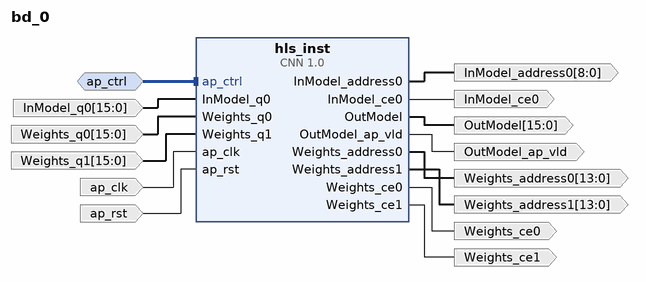
[diagram p0: block diagram of the top level]
# Vivado block design bd_0, xck26-sfvc784-2LV-c, Vivado 2023.1
create_bd_design bd_0

create_bd_intf_port -mode Slave -vlnv xilinx.com:interface:acc_handshake_rtl:1.0 ap_ctrl
create_bd_port -dir O -from 8 -to 0 -type data InModel_address0
create_bd_port -dir O InModel_ce0
create_bd_port -dir I -from 15 -to 0 -type data InModel_q0
create_bd_port -dir O -from 15 -to 0 -type data OutModel
create_bd_port -dir O OutModel_ap_vld
create_bd_port -dir O -from 13 -to 0 -type data Weights_address0
create_bd_port -dir O -from 13 -to 0 -type data Weights_address1
create_bd_port -dir O Weights_ce0
create_bd_port -dir O Weights_ce1
create_bd_port -dir I -from 15 -to 0 -type data Weights_q0
create_bd_port -dir I -from 15 -to 0 -type data Weights_q1
create_bd_port -dir I -type clk ap_clk
set_property -dict {CONFIG.FREQ_HZ 200000000.0} [get_bd_ports ap_clk]
create_bd_port -dir I -type rst ap_rst
set_property -dict {CONFIG.POLARITY ACTIVE_HIGH} [get_bd_ports ap_rst]

create_bd_cell -type ip -vlnv xilinx.com:hls:CNN:1.0 hls_inst

# ---- connections ----

connect_bd_intf_net -intf_net ap_ctrl_0_1 [get_bd_intf_ports ap_ctrl] [get_bd_intf_pins hls_inst/ap_ctrl]
connect_bd_net -net InModel_q0_0_1 [get_bd_ports InModel_q0] [get_bd_pins hls_inst/InModel_q0]
connect_bd_net -net Weights_q0_0_1 [get_bd_ports Weights_q0] [get_bd_pins hls_inst/Weights_q0]
connect_bd_net -net Weights_q1_0_1 [get_bd_ports Weights_q1] [get_bd_pins hls_inst/Weights_q1]
connect_bd_net -net ap_clk_0_1 [get_bd_ports ap_clk] [get_bd_pins hls_inst/ap_clk]
connect_bd_net -net ap_rst_0_1 [get_bd_ports ap_rst] [get_bd_pins hls_inst/ap_rst]
connect_bd_net [get_bd_pins hls_inst/InModel_address0] [get_bd_ports InModel_address0]
connect_bd_net [get_bd_pins hls_inst/InModel_ce0] [get_bd_ports InModel_ce0]
connect_bd_net [get_bd_pins hls_inst/OutModel] [get_bd_ports OutModel]
connect_bd_net [get_bd_pins hls_inst/OutModel_ap_vld] [get_bd_ports OutModel_ap_vld]
connect_bd_net [get_bd_pins hls_inst/Weights_address0] [get_bd_ports Weights_address0]
connect_bd_net [get_bd_pins hls_inst/Weights_address1] [get_bd_ports Weights_address1]
connect_bd_net [get_bd_pins hls_inst/Weights_ce0] [get_bd_ports Weights_ce0]
connect_bd_net [get_bd_pins hls_inst/Weights_ce1] [get_bd_ports Weights_ce1]

validate_bd_design
save_bd_design
